# EAGLE design Pi_Interface (EAGLE 9.6.2)
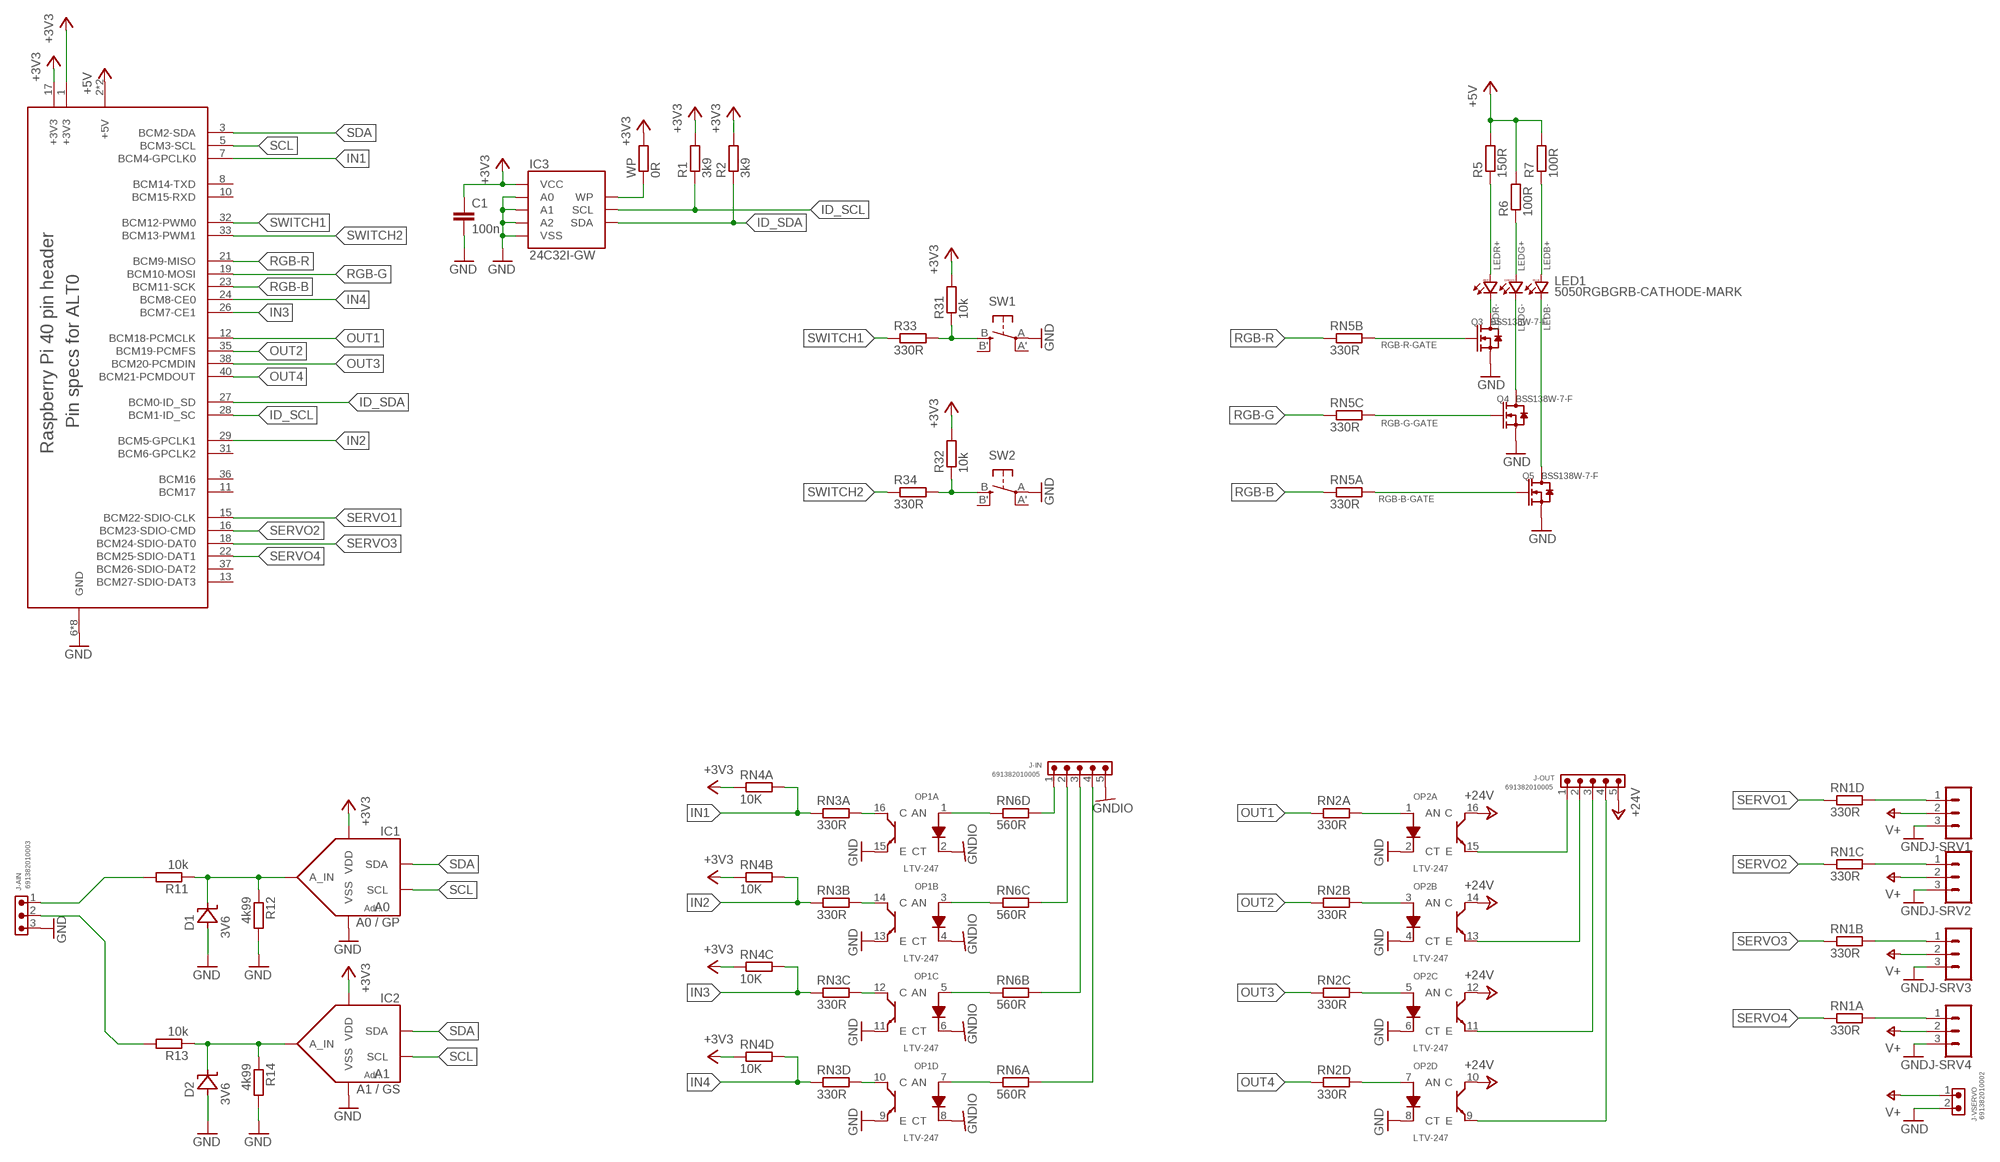
[diagram p0: schematic, sheet 1]

## Parts
C1  100n  C-EUC0603  [C0603]
D1  3V6  ZENERSOD-123  [SOD3716X115N]
D2  3V6  ZENERSOD-123  [SOD3716X115N]
IC1  A0 / GP  MCP3021A0T-E/OT  [SOT95P280X145-5N]
IC2  A1 / GS  MCP3021A1T-E/OT  [SOT95P280X145-5N]
IC3  24C32I-GW  [SOIC127P600X175-8N]
J3  RASPI-40HAT  [FE20-2]
J-AIN  691382010003  691382010003  [691382010003]
J-IN  691382010005  691382010005  [691382010005]
J-OUT  691382010005  691382010005  [691382010005]
J-SRV1  MA03-1  [MA03-1]
J-SRV2  MA03-1  [MA03-1]
J-SRV3  MA03-1  [MA03-1]
J-SRV4  MA03-1  [MA03-1]
J-VSERVO  691382010002  691382010002  [691382010002]
LED1  5050RGBGRB-CATHODE-MARK  [CATH_MARK_5050_PLCC6]
OP1  LTV-247  [SOIC127P675X220-16N]
OP2  LTV-247  [SOIC127P675X220-16N]
Q3  BSS138W-7-F  SMD-MOSFET-N-CH-50V-200MA-BSS138W-7-F(SOT-23)  [SOT-23]
Q4  BSS138W-7-F  SMD-MOSFET-N-CH-50V-200MA-BSS138W-7-F(SOT-23)  [SOT-23]
Q5  BSS138W-7-F  SMD-MOSFET-N-CH-50V-200MA-BSS138W-7-F(SOT-23)  [SOT-23]
R1  3k9  R-EU_R0603  [R0603]
R2  3k9  R-EU_R0603  [R0603]
R5  150R  R-EU_R0603  [R0603]
R6  100R  R-EU_R0603  [R0603]
R7  100R  R-EU_R0603  [R0603]
R11  10k  R-EU_R0603  [R0603]
R12  4k99  R-EU_R0603  [R0603]
R13  10k  R-EU_R0603  [R0603]
R14  4k99  R-EU_R0603  [R0603]
R31  10k  R-EU_R0603  [R0603]
R32  10k  R-EU_R0603  [R0603]
R33  330R  R-EU_R0603  [R0603]
R34  330R  R-EU_R0603  [R0603]
RN1  330R  R-NET4-1206C  [RESCAV80P315X160X60-8N]
RN2  330R  R-NET4-1206C  [RESCAV80P315X160X60-8N]
RN3  330R  R-NET4-1206  [RESCAXS80P315X160X60-8N]
RN4  10K  R-NET4-1206  [RESCAXS80P315X160X60-8N]
RN5  330R  R-NET4-1206C  [RESCAV80P315X160X60-8N]
RN6  560R  R-NET4-1206  [RESCAXS80P315X160X60-8N]
SW1  SPST_TACT-PT645  [PT645-SMT]
SW2  SPST_TACT-PT645  [PT645-SMT]
WP  0R  R-EU_R0603  [R0603]

## Nets
+3V3: C1.1 IC1.1(VDD) IC2.1(VDD) IC3.8(VCC) J3.1(+3V3) J3.17(+3V3) R1.2 R2.2 R31.2 R32.2 RN4.1 RN4.2 RN4.3 RN4.4 WP.2
+5V: J3.2(+5V) J3.4(+5V) R5.2 R6.2 R7.2
+24V: J-OUT.5 OP2.10(D:C) OP2.12(C:C) OP2.14(B:C) OP2.16(A:C)
AIN1: J-AIN.1 R11.2
AIN2: J-AIN.2 R13.2
GND: C1.2 D1.2(A) D2.2(A) IC1.2(VSS) IC2.2(VSS) IC3.1(A0) IC3.2(A1) IC3.3(A2) IC3.4(VSS) J3.6(GND) J3.9(GND) J3.14(GND) J3.20(GND) J3.25(GND) J3.30(GND) J3.34(GND) J3.39(GND) J-AIN.3 J-SRV1.3 J-SRV2.3 J-SRV3.3 J-SRV4.3 J-VSERVO.2 OP1.9(D:E) OP1.11(C:E) OP1.13(B:E) OP1.15(A:E) OP2.2(A:CT) OP2.4(B:CT) OP2.6(C:CT) OP2.8(D:CT) Q3.2(S) Q4.2(S) Q5.2(S) R12.2 R14.2 SW1.A(P) SW2.A(P)
GNDIO: J-IN.5 OP1.2(A:CT) OP1.4(B:CT) OP1.6(C:CT) OP1.8(D:CT)
ID_SCL: IC3.6(SCL) J3.28(BCM1-ID_SC) R1.1
ID_SDA: IC3.5(SDA) J3.27(BCM0-ID_SD) R2.1
IN1: J3.7(BCM4-GPCLK0) RN3.1 RN4.8
IN2: J3.29(BCM5-GPCLK1) RN3.2 RN4.7
IN3: J3.26(BCM7-CE1) RN3.3 RN4.6
IN4: J3.24(BCM8-CE0) RN3.4 RN4.5
LEDB+: LED1.3(B+) R7.1
LEDB-: LED1.4(B-) Q5.3(D)
LEDG+: LED1.1(G+) R6.1
LEDG-: LED1.6(G-) Q4.3(D)
LEDR+: LED1.2(R+) R5.1
LEDR-: LED1.5(R-) Q3.3(D)
N$1: J-SRV1.1 RN1.5
N$2: J-SRV2.1 RN1.6
N$3: J-SRV3.1 RN1.7
N$4: J-SRV4.1 RN1.8
N$5: D1.1(C) IC1.3(A_IN) R11.1 R12.1
N$6: D2.1(C) IC2.3(A_IN) R13.1 R14.1
N$9: J-OUT.1 OP2.15(A:E)
N$10: J-OUT.2 OP2.13(B:E)
N$11: J-OUT.3 OP2.11(C:E)
N$12: J-OUT.4 OP2.9(D:E)
N$13: OP2.1(A:AN) RN2.8
N$14: OP2.3(B:AN) RN2.7
N$15: OP2.5(C:AN) RN2.6
N$16: OP2.7(D:AN) RN2.5
N$17: OP1.1(A:AN) RN6.4
N$18: OP1.3(B:AN) RN6.3
N$19: OP1.5(C:AN) RN6.2
N$20: OP1.7(D:AN) RN6.1
N$21: J-IN.1 RN6.5
N$22: J-IN.2 RN6.6
N$23: J-IN.3 RN6.7
N$24: J-IN.4 RN6.8
N$25: OP1.10(D:C) RN3.5
N$26: R32.1 R34.2 SW2.B(S)
N$27: OP1.12(C:C) RN3.6
N$29: OP1.14(B:C) RN3.7
N$31: OP1.16(A:C) RN3.8
N$32: R31.1 R33.2 SW1.B(S)
OUT1: J3.12(BCM18-PCMCLK) RN2.1
OUT2: J3.35(BCM19-PCMFS) RN2.2
OUT3: J3.38(BCM20-PCMDIN) RN2.3
OUT4: J3.40(BCM21-PCMDOUT) RN2.4
RGB-B: J3.23(BCM11-SCK) RN5.1
RGB-B-GATE: Q5.1(G) RN5.8
RGB-G: J3.19(BCM10-MOSI) RN5.3
RGB-G-GATE: Q4.1(G) RN5.6
RGB-R: J3.21(BCM9-MISO) RN5.2
RGB-R-GATE: Q3.1(G) RN5.7
SCL: IC1.5(SCL) IC2.5(SCL) J3.5(BCM3-SCL)
SDA: IC1.4(SDA) IC2.4(SDA) J3.3(BCM2-SDA)
SERVO1: J3.15(BCM22-SDIO-CLK) RN1.4
SERVO2: J3.16(BCM23-SDIO-CMD) RN1.3
SERVO3: J3.18(BCM24-SDIO-DAT0) RN1.2
SERVO4: J3.22(BCM25-SDIO-DAT1) RN1.1
SWITCH1: J3.32(BCM12-PWM0) R33.1
SWITCH2: J3.33(BCM13-PWM1) R34.1
V+: J-SRV1.2 J-SRV2.2 J-SRV3.2 J-SRV4.2 J-VSERVO.1
WP: IC3.7(WP) WP.1
Unconnected: J3.8(BCM14-TXD) J3.10(BCM15-RXD) J3.11(BCM17) J3.13(BCM27-SDIO-DAT3) J3.31(BCM6-GPCLK2) J3.36(BCM16) J3.37(BCM26-SDIO-DAT2) RN5.4 RN5.5 SW1.A'(P1) SW1.B'(S1) SW2.A'(P1) SW2.B'(S1)

## Library data of the parts
C1 = rcl:C-EU: CAPACITOR, European symbol; SPICEPREFIX: C
D1 D2 = zener-diodes:ZENER
IC1 = adconverter:MCP3021; ADR: A0; CODE: GP
IC2 = adconverter:MCP3021; ADR: A1; CODE: GS
IC3 = eeprom:24C32
J3 = PiHeader:RASPI-40: Raspberry Pi 40 pin header
J-AIN = Wurth_Connectors_WR-TBL Pluggable Connector:691382010003: WR-TBL Serie 382 - 2.50 mm Horizontal PCB Header KIND PROPERTIES Pitch 2.5 mm MATERIAL PROPERTIES Insulator Material PA66 Insulator Flammability Rating UL94 V-0 Contact Material Copper Alloy Contact Plating Tin Contact Type Stamped GENERAL INFORMATION Operating Temperature -40 up to +105 °C Compliance RoHS ELECTRICAL PROPERTIES IR cULus 12 A Working Voltage [cULus] 300 V (AC) Withstanding Voltage [cULus] 1000 V (AC) Contact Resistance [cULus] 20 mΩ CERTIFICATION cULus Approval E315414 <https://www.we-online.com/catalog/media/o55402v209%20Family_WR-TBL_Serie_382_6913820100xx.jpg> Details see: https://www.we-online.com/catalog/en/TBL_2_50_382_HORIZONTAL_PCB_HEADER_69138201000X/ Updated by Ella Wu 2019-12-13 2019(C) Wurth Elektronik; DATASHEET-URL: https://www.we-online.com/catalog/datasheet/691382010003.pdf; IR-UL: 12A; MOUNT: THT; PART-NUMBER: 691382010003; PINS: 3; PITCH: 2.5mm; TYPE: Horizontal; WORKING-VOLTAGE-UL: 300V (AC)
J-IN J-OUT = Wurth_Connectors_WR-TBL Pluggable Connector:691382010005: WR-TBL Serie 382 - 2.50 mm Horizontal PCB Header KIND PROPERTIES Pitch 2.5 mm MATERIAL PROPERTIES Insulator Material PA66 Insulator Flammability Rating UL94 V-0 Contact Material Copper Alloy Contact Plating Tin Contact Type Stamped GENERAL INFORMATION Operating Temperature -40 up to +105 °C Compliance RoHS ELECTRICAL PROPERTIES IR cULus 12 A Working Voltage [cULus] 300 V (AC) Withstanding Voltage [cULus] 1000 V (AC) Contact Resistance [cULus] 20 mΩ CERTIFICATION cULus Approval E315414 <https://www.we-online.com/catalog/media/o55402v209%20Family_WR-TBL_Serie_382_6913820100xx.jpg> Details see: https://www.we-online.com/catalog/en/TBL_2_50_382_HORIZONTAL_PCB_HEADER_69138201000X/ Updated by Ella Wu 2019-12-13 2019(C) Wurth Elektronik; DATASHEET-URL: https://www.we-online.com/catalog/datasheet/691382010005.pdf; IR-UL: 12A; MOUNT: THT; PART-NUMBER: 691382010005; PINS: 5; PITCH: 2.5mm; TYPE: Horizontal; WORKING-VOLTAGE-UL: 300V (AC)
J-SRV1-J-SRV4 = con-lstb:MA03-1: PIN HEADER; OC_FARNELL: unknown; OC_NEWARK: unknown
J-VSERVO = Wurth_Connectors_WR-TBL Pluggable Connector:691382010002: WR-TBL Serie 382 - 2.50 mm Horizontal PCB Header KIND PROPERTIES Pitch 2.5 mm MATERIAL PROPERTIES Insulator Material PA66 Insulator Flammability Rating UL94 V-0 Contact Material Copper Alloy Contact Plating Tin Contact Type Stamped GENERAL INFORMATION Operating Temperature -40 up to +105 °C Compliance RoHS ELECTRICAL PROPERTIES IR cULus 12 A Working Voltage [cULus] 300 V (AC) Withstanding Voltage [cULus] 1000 V (AC) Contact Resistance [cULus] 20 mΩ CERTIFICATION cULus Approval E315414 <https://www.we-online.com/catalog/media/o55402v209%20Family_WR-TBL_Serie_382_6913820100xx.jpg> Details see: https://www.we-online.com/catalog/en/TBL_2_50_382_HORIZONTAL_PCB_HEADER_69138201000X/ Updated by Ella Wu 2019-12-13 2019(C) Wurth Elektronik; DATASHEET-URL: https://www.we-online.com/catalog/datasheet/691382010002.pdf; IR-UL: 12A; MOUNT: THT; PART-NUMBER: 691382010002; PINS: 2; PITCH: 2.5mm; TYPE: Horizontal; WORKING-VOLTAGE-UL: 300V (AC)
LED1 = rgb-leds:5050RGB
OP1 OP2 = optocoupler:LTV-247; LCSC_PART: C115451; MPN: LTV-247
Q3-Q5 = OPL_Discrete_Semiconductor:SMD-MOSFET-N-CH-50V-200MA-BSS138W-7-F(SOT-23): 305030000; MPN: BSS138W-7-F
R1 R2 R5-R7 R11-R14 R31-R34 WP = rcl:R-EU_: RESISTOR, European symbol; SPICEPREFIX: R
RN1 RN2 RN5 = resistor-network:R-NET4-; MANUFACTURER: YAGEO; MPN: TC164-F*
RN3 RN4 RN6 = resistor-network:R-NET4-; MANUFACTURER: YAGEO; MPN: YC164-F*
SW1 SW2 = sw-tactile:SPST_TACT: SMT 6mm switch, EVQQ2 series http://www.ladyada.net/library/eagle; MPN: PTS645SM43SMTR92LFS; OC_FARNELL: 2320087

## Net classes
0 default: drill 0.3 mm, clearance 0.165 mm

## Board
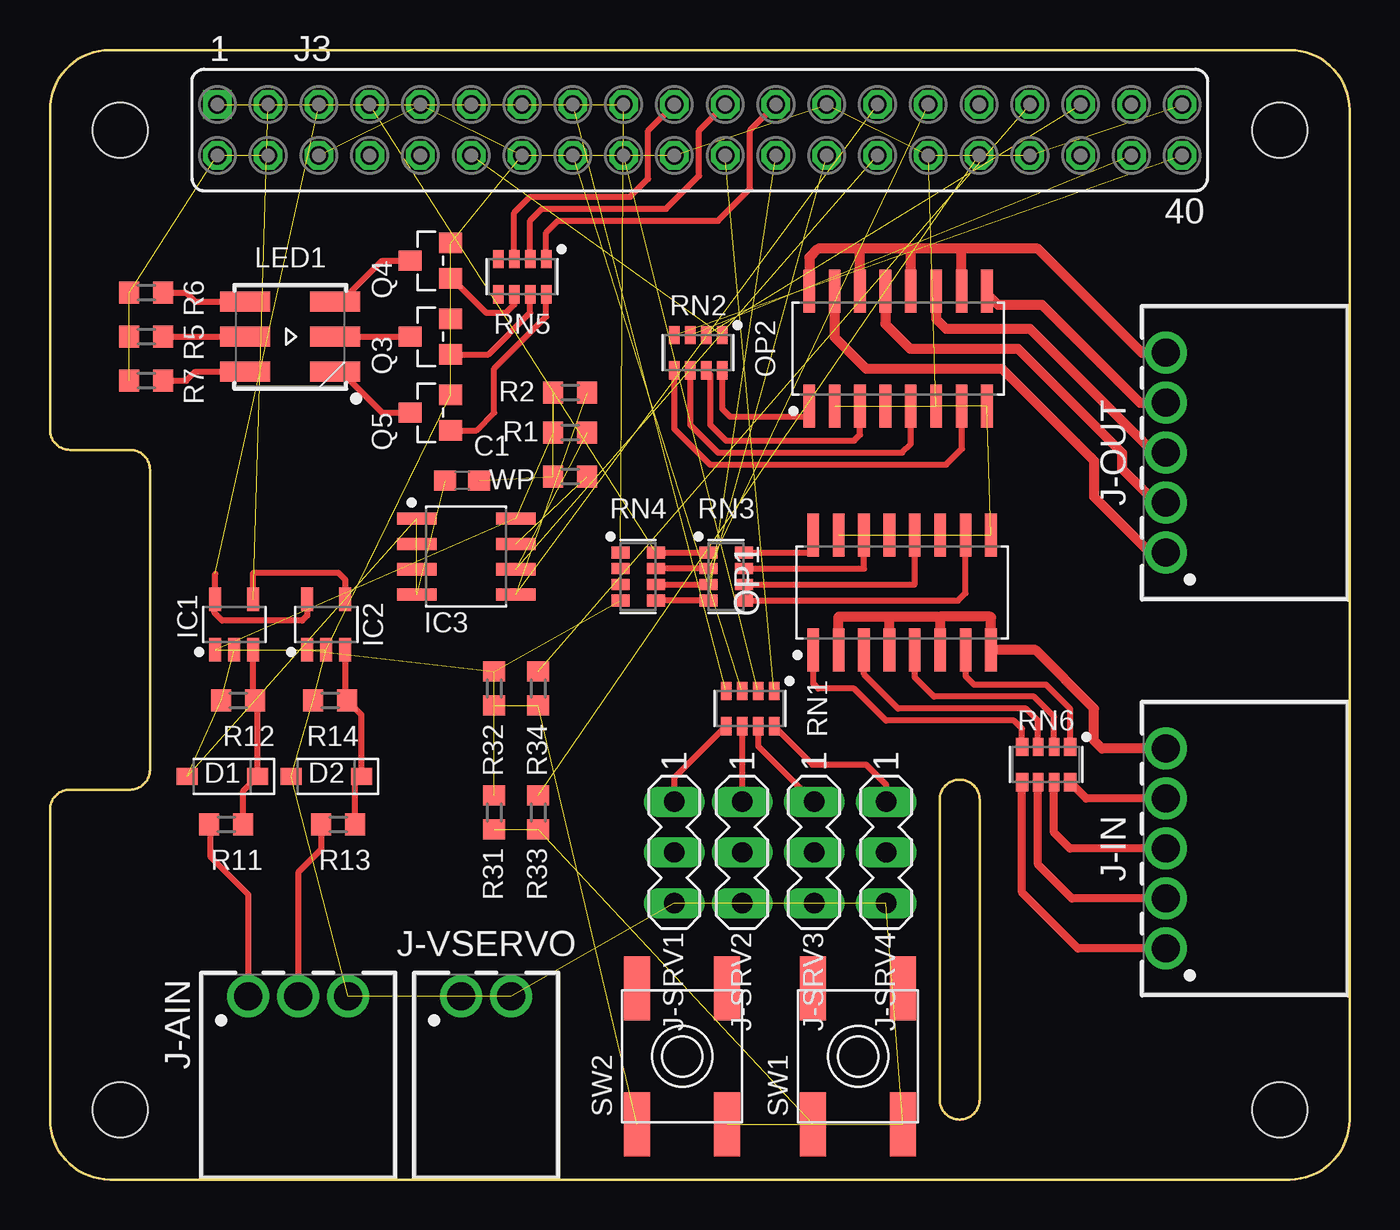
[diagram p1: board, top side]
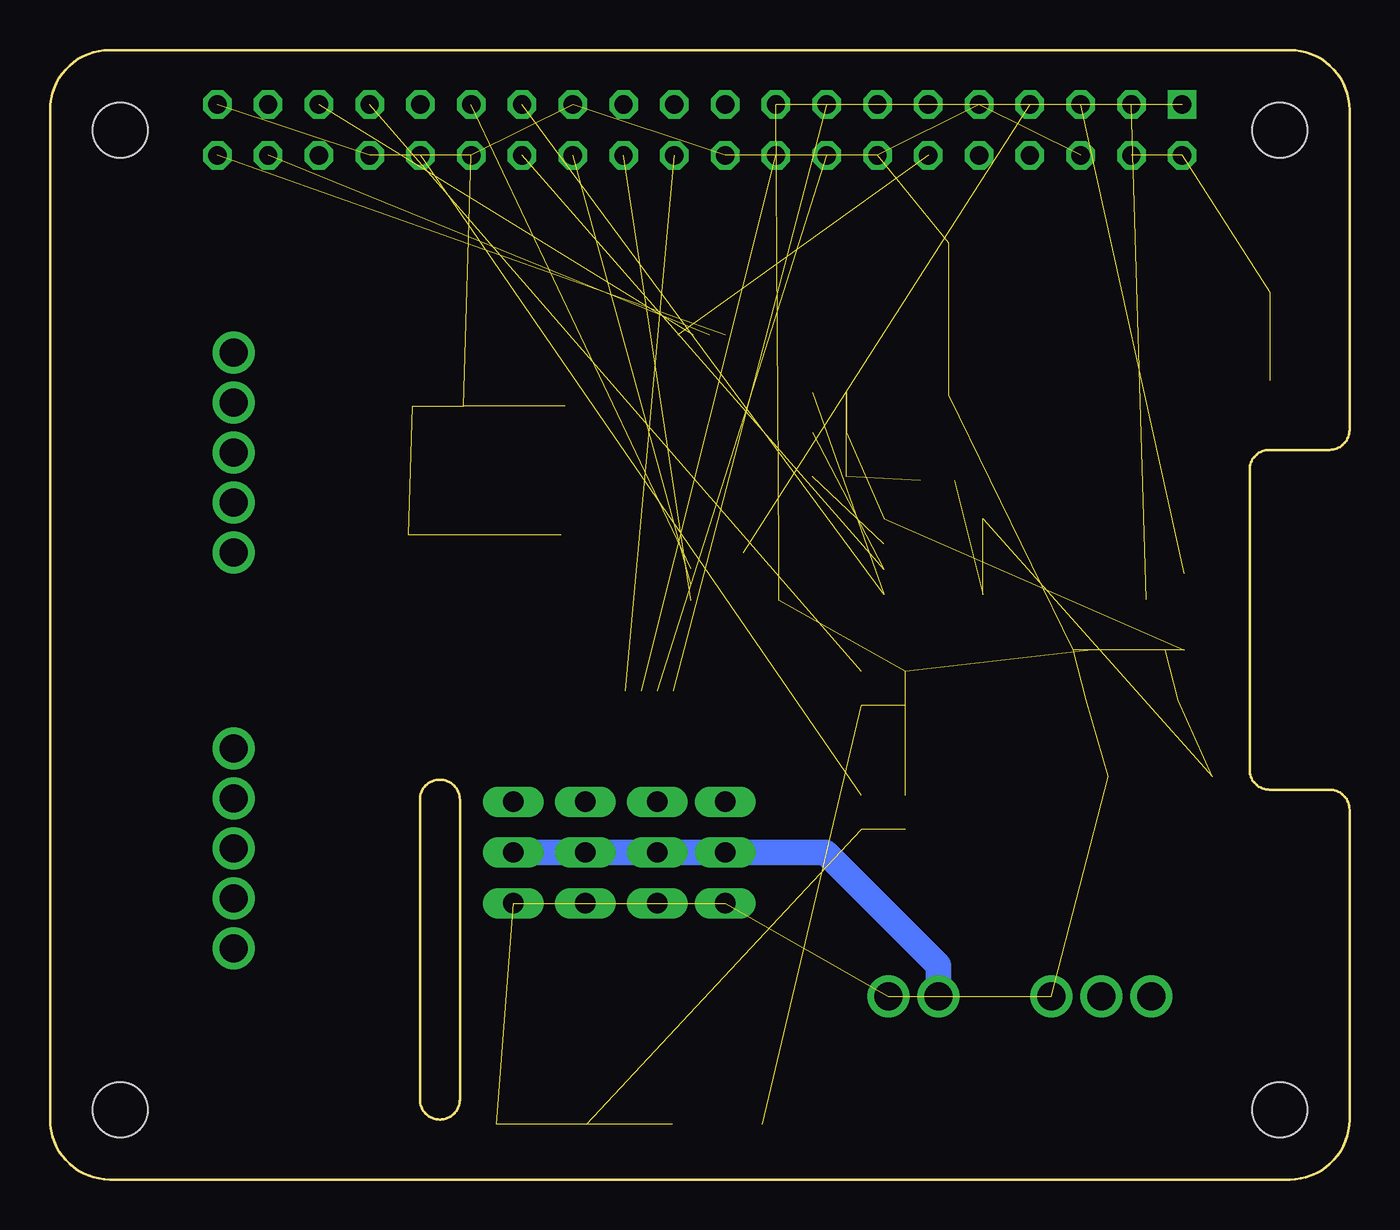
[diagram p2: board, bottom side, seen from below]

Size 65 x 56.5 mm. Coordinates in mm from the lower left corner, seen from the top.
Copper layers (1*16): Top 0.035mm / dielectric 1.5mm / Bottom 0.035mm
Design rules "default": minimum track width 6mil, minimum drill 0.35mm, track to track 6mil, track to pad 6mil, pad to pad 6mil, via to via 6mil, smd to smd 6mil, copper to edge 40mil, drill to drill 6mil, minimum pad ring 10mil, minimum via ring 8mil, stop-mask expansion 4mil, vias tented up to drill 0mil, thermal gap 10mil

### Footprints (pad centres in the part's own frame; a part is rotated, then mirrored left to right if it is on the bottom)
C0603 = smd 1.1 x 1: 1 -0.85,0; 2 0.85,0
SOD3716X115N = smd 1.046 x 0.839: 1 -1.762,0; 2 1.762,0
SOT95P280X145-5N = smd 1.186 x 0.597: 1 -1.264,0.95; 2 -1.264,0; 3 -1.264,-0.95; 4 1.264,-0.95; 5 1.264,0.95
SOIC127P600X175-8N = smd 1.968 x 0.602: 1 -2.473,1.905; 2 -2.473,0.635; 3 -2.473,-0.635; 4 -2.473,-1.905; 5 2.473,-1.905; 6 2.473,-0.635; 7 2.473,0.635; 8 2.473,1.905
FE20-2 = drill 0.914 square: 1 -24.13,1.27 | drill 0.914 octagon: 2 -24.13,-1.27; 3 -21.59,1.27; 4 -21.59,-1.27; 5 -19.05,1.27; 6 -19.05,-1.27; 7 -16.51,1.27; 8 -16.51,-1.27; 9 -13.97,1.27; 10 -13.97,-1.27; 11 -11.43,1.27; 12 -11.43,-1.27; 13 -8.89,1.27; 14 -8.89,-1.27; 15 -6.35,1.27; 16 -6.35,-1.27; 17 -3.81,1.27; 18 -3.81,-1.27; 19 -1.27,1.27; 20 -1.27,-1.27; 21 1.27,1.27; 22 1.27,-1.27; 23 3.81,1.27; 24 3.81,-1.27; 25 6.35,1.27; 26 6.35,-1.27; 27 8.89,1.27; 28 8.89,-1.27; 29 11.43,1.27; 30 11.43,-1.27; 31 13.97,1.27; 32 13.97,-1.27; 33 16.51,1.27; 34 16.51,-1.27; 35 19.05,1.27; 36 19.05,-1.27; 37 21.59,1.27; 38 21.59,-1.27; 39 24.13,1.27; 40 24.13,-1.27 | hole 2.75: -29,0; 29,0; -29,-49; 29,-49
691382010003 = drill 1.4: 1 -2.5,0; 2 0,0; 3 2.5,0
691382010005 = drill 1.4: 1 -5,0; 2 -2.5,0; 3 0,0; 4 2.5,0; 5 5,0
MA03-1 = drill 1.016 long: 1 -2.54,0; 2 0,0; 3 2.54,0
691382010002 = drill 1.4: 1 -1.25,0; 2 1.25,0
CATH_MARK_5050_PLCC6 = smd 2.5 x 1: 1 -2.25,1.75; 2 -2.25,0; 3 -2.25,-1.75; 4 2.25,-1.75; 5 2.25,0; 6 2.25,1.75
SOIC127P675X220-16N = smd 2.147 x 0.589: 1 -2.88,4.445; 2 -2.88,3.175; 3 -2.88,1.905; 4 -2.88,0.635; 5 -2.88,-0.635; 6 -2.88,-1.905; 7 -2.88,-3.175; 8 -2.88,-4.445; 9 2.88,-4.445; 10 2.88,-3.175; 11 2.88,-1.905; 12 2.88,-0.635; 13 2.88,0.635; 14 2.88,1.905; 15 2.88,3.175; 16 2.88,4.445
SOT-23 = smd 1.016 x 1.143: 1 -0.889,-1.016; 2 0.889,-1.016; 3 0,1.016
R0603 = smd 1 x 1.1: 1 -0.85,0; 2 0.85,0
RESCAV80P315X160X60-8N = smd 0.901 x 0.53: 1 -0.885,1.2; 2 -0.885,0.4; 3 -0.885,-0.4; 4 -0.885,-1.2; 5 0.885,-1.2; 6 0.885,-0.4; 7 0.885,0.4; 8 0.885,1.2
RESCAXS80P315X160X60-8N = smd 0.901 x 0.61: 1 -0.885,1.2; 4 -0.885,-1.2; 5 0.885,-1.2; 8 0.885,1.2 | smd 0.901 x 0.53: 2 -0.885,0.4; 3 -0.885,-0.4; 6 0.885,-0.4; 7 0.885,0.4
PT645-SMT = smd 3.2 x 1.3: A -3.4,-2.25; A' 3.4,-2.25; B -3.4,2.25; B' 3.4,2.25

### Placement (x,y rotation side)
C1  20.62,34.96 180 top
D1  8.62,20.16 180 top
D2  13.82,20.16 180 top
IC1  9.22,27.76 90 top
IC2  13.82,27.76 90 top
IC3  20.82,31.16 0 top
J3  32.5,52.5 0 top
J-AIN  12.42,9.16 0 top
J-IN  55.82,16.56 90 top
J-OUT  55.82,36.36 90 top
J-SRV1  31.22,16.36 270 top
J-SRV2  34.62,16.36 270 top
J-SRV3  38.22,16.36 270 top
J-SRV4  41.82,16.36 270 top
J-VSERVO  21.82,9.16 0 top
LED1  12.02,42.16 0 top
OP1  42.62,29.36 90 top
OP2  42.42,41.56 90 top
Q3  19.02,42.16 90 top
Q4  19.02,45.96 90 top
Q5  19.02,38.36 90 top
R1  26.02,37.36 180 top
R2  26.02,39.36 180 top
R5  4.82,42.16 180 top
R6  4.82,44.36 180 top
R7  4.82,39.96 180 top
R11  8.82,17.76 180 top
R12  9.42,23.96 180 top
R13  14.42,17.76 180 top
R14  14.02,23.96 180 top
R31  22.22,18.36 90 top
R32  22.22,24.56 90 top
R33  24.42,18.36 270 top
R34  24.42,24.56 270 top
RN1  35.02,23.56 270 top
RN2  32.42,41.36 270 top
RN3  33.82,30.16 0 top
RN4  29.42,30.16 0 top
RN5  23.62,45.16 270 top
RN6  49.82,20.76 270 top
SW1  40.42,6.16 90 top
SW2  31.62,6.16 90 top
WP  26.02,35.16 180 top

### Tracks (layer width: path | path; a pad name or v marks a point on that pad's centre or on a via)
+3V3  (14 unrouted)
+5V  (4 unrouted)
+24V
  Top 0.508: J-OUT.5 54.62,41.36 49.42,46.56 45.62,46.56 | 45.62,46.56 43.02,46.56 | 43.02,46.56 40.62,46.56 | 40.62,46.56 38.42,46.56 37.98,46.11 OP2.16 | OP2.14 40.52,46.45 40.62,46.56 | OP2.12 43.05,46.52 43.02,46.56 | OP2.10 45.59,46.53 45.62,46.56
AIN1
  Top 0.305: R11.2 8.02,17.71 8.02,16.16 9.92,14.26 J-AIN.1
AIN2
  Top 0.305: R13.2 13.57,16.51 12.42,15.36 J-AIN.2
GND  (37 unrouted)
GNDIO
  Top 0.508: J-IN.5 52.62,21.56 52.22,21.96 52.22,23.56 49.3,26.48 OP1.8 47.06,28.11 47.02,28.16 44.52,28.16 | 44.52,28.16 OP1.6 | OP1.4 41.98,28.16 | 41.98,28.16 44.52,28.16 | OP1.2 39.45,28.16 41.98,28.16
ID_SCL  (2 unrouted)
ID_SDA  (2 unrouted)
IN1  (1 unrouted)
  Top 0.305: RN4.8 RN3.1
IN2  (1 unrouted)
  Top 0.305: RN3.2 RN4.7
IN3  (1 unrouted)
  Top 0.305: RN4.6 RN3.3
IN4  (1 unrouted)
  Top 0.305: RN3.4 RN4.5
LEDB+
  Top 0.305: R7.1 6.82,39.96 7.27,40.41 LED1.3
LEDB-
  Top 0.305: LED1.4 14.57,40.41 16.62,38.36 Q5.3
LEDG+
  Top 0.305: R6.1 6.82,44.36 7.27,43.91 LED1.1
LEDG-
  Top 0.305: LED1.6 14.57,43.91 16.62,45.96 Q4.3
LEDR+
  Top 0.305: R5.1 LED1.2
LEDR-
  Top 0.305: LED1.5 Q3.3
N$1
  Top 0.305: RN1.5 31.22,20.07 J-SRV1.1
N$2
  Top 0.305: RN1.6 J-SRV2.1
N$3
  Top 0.305: RN1.7 35.42,21.7 J-SRV3.1
N$4
  Top 0.305: RN1.8 38.13,20.76 40.82,20.76 41.82,19.76 J-SRV4.1
N$5
  Top 0.305: R11.1 9.67,19.45 D1.1 10.38,23.85 R12.1 10.27,24 10.17,24.1 IC1.3
N$6
  Top 0.305: R13.1 15.27,19.85 D2.1 15.58,23.25 R14.1 14.87,24 14.77,24.1 IC2.3
N$9
  Top 0.508: OP2.15 39.24,42.13 40.82,40.56 47.62,40.56 52.22,35.96 52.22,34.16 55.02,31.36 J-OUT.1
N$10
  Top 0.508: OP2.13 41.78,42.79 43.02,41.56 48.42,41.56 53.62,36.36 53.62,35.56 55.32,33.86 J-OUT.2
N$11
  Top 0.508: OP2.11 44.32,43.05 44.82,42.56 49.02,42.56 55.22,36.36 J-OUT.3
N$12
  Top 0.508: OP2.9 46.87,44.31 47.42,43.76 49.62,43.76 54.52,38.86 J-OUT.4
N$13
  Top 0.305: RN2.8 33.62,38.56 34.02,38.16 37.82,38.16 37.98,38.31 OP2.1
N$14
  Top 0.305: RN2.7 33.02,40.27 33.02,37.76 33.82,36.96 40.22,36.96 40.52,37.25 OP2.3
N$15
  Top 0.305: RN2.6 32.02,37.76 33.42,36.36 42.62,36.36 43.05,36.79 OP2.5
N$16
  Top 0.305: RN2.5 31.22,37.56 33.02,35.76 44.82,35.76 45.62,36.56 45.62,38.66 OP2.7
N$17
  Top 0.305: RN6.4 48.62,22.56 48.22,22.96 41.82,22.96 40.22,24.56 38.42,24.56 38.17,24.8 OP1.1
N$18
  Top 0.305: OP1.3 40.71,25.26 42.42,23.56 48.82,23.56 49.42,22.96 RN6.3
N$19
  Top 0.305: OP1.5 43.25,25.12 44.22,24.16 49.22,24.16 50.22,23.16 RN6.2
N$20
  Top 0.305: OP1.7 45.8,25.18 46.22,24.76 49.82,24.76 51.02,23.56 RN6.1
N$21
  Top 0.406: J-IN.1 51.42,11.56 48.62,14.36 RN6.5
N$22
  Top 0.406: 55.52,13.76 J-IN.2 51.12,14.06 49.42,15.76 RN6.6
N$23
  Top 0.406: J-IN.3 51.02,16.56 50.22,17.36 RN6.7
N$24
  Top 0.406: J-IN.4 51.84,19.06 RN6.8
N$25
  Top 0.305: RN3.5 45.42,28.96 45.8,29.33 OP1.10
N$26  (2 unrouted)
N$27
  Top 0.305: RN3.6 43.22,29.76 43.25,29.79 OP1.12
N$29
  Top 0.305: RN3.7 40.71,30.56 OP1.14
N$31
  Top 0.305: RN3.8 38.17,31.36 OP1.16
N$32  (2 unrouted)
OUT1  (1 unrouted)
OUT2  (1 unrouted)
OUT3  (1 unrouted)
OUT4  (1 unrouted)
RGB-B
  Top 0.305: RN5.1 24.82,47.36 25.42,47.96 33.42,47.96 35.02,49.56 35.02,52.48 J3.23
RGB-B-GATE
  Top 0.305: Q5.1 21.33,37.47 22.22,38.36 22.22,40.56 24.82,43.16 RN5.8
RGB-G
  Top 0.305: RN5.3 23.22,48.36 24.02,49.16 29.02,49.16 29.92,50.06 29.92,52.46 J3.19
RGB-G-GATE
  Top 0.305: Q4.1 20.11,45.07 21.82,43.36 22.82,43.36 23.22,43.76 RN5.6
RGB-R
  Top 0.305: RN5.2 24.02,47.96 24.62,48.56 30.82,48.56 32.47,50.21 32.47,52.47 J3.21
RGB-R-GATE
  Top 0.305: Q3.1 21.93,41.27 24.02,43.36 RN5.7
SCL  (1 unrouted)
  Top 0.305: IC2.5 12.87,28.21 12.62,27.96 8.62,27.96 8.22,28.36 8.22,28.97 IC1.5 8.27,30.31
SDA  (1 unrouted)
  Top 0.305: IC1.4 10.17,30.36 14.42,30.36 14.77,30.01 IC2.4
SERVO1  (1 unrouted)
SERVO2  (1 unrouted)
SERVO3  (1 unrouted)
SERVO4  (1 unrouted)
SWITCH1  (1 unrouted)
SWITCH2  (1 unrouted)
V+
  Bottom 1.27: J-VSERVO.1 20.57,10.71 26.22,16.36 J-SRV1.2 J-SRV2.2 J-SRV3.2 J-SRV4.2
WP  (1 unrouted)